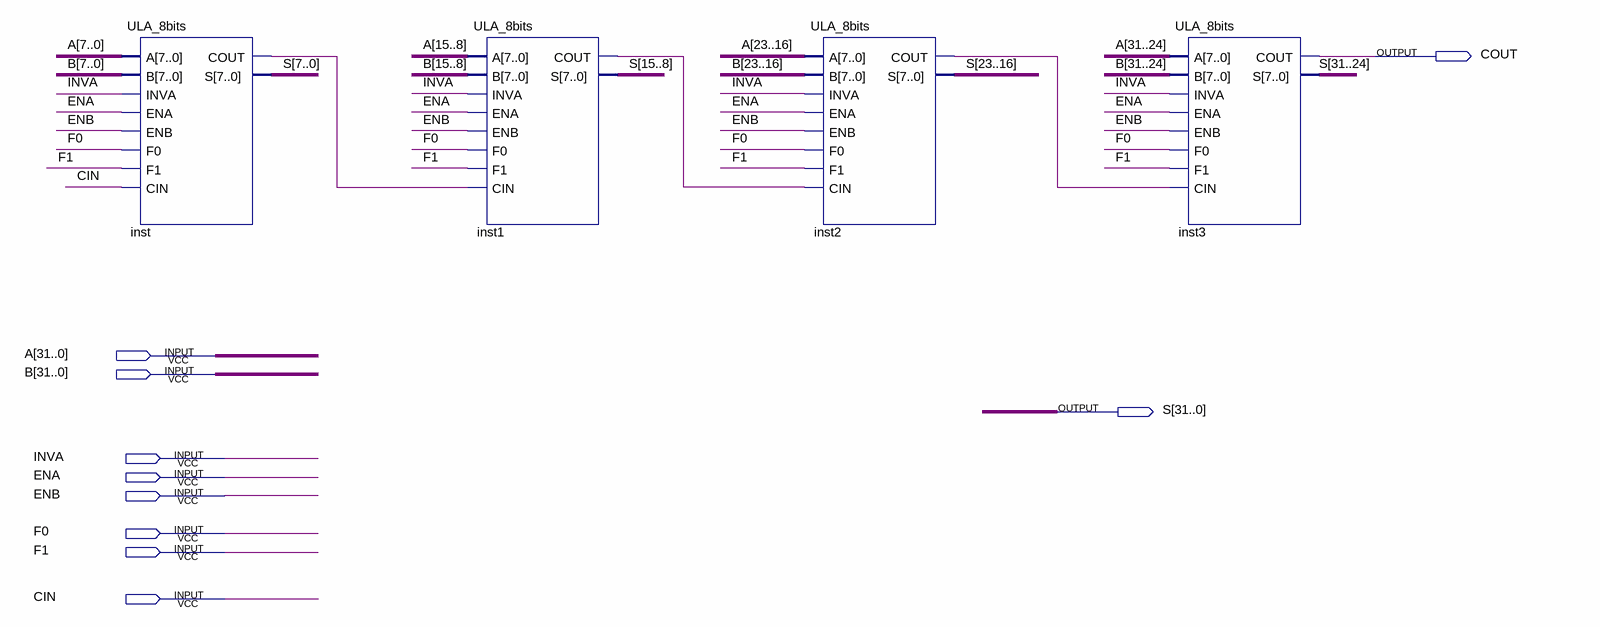
[diagram p0: schematic sheet]
// Quartus schematic ULA_32.bdf as structural Verilog: 4 symbols, 10 pins
module ULA_32 (
  input  [31:0] A,
  input  [31:0] B,
  input  INVA,
  input  ENA,
  input  ENB,
  input  F0,
  input  F1,
  input  CIN,
  output COUT,
  output [31:0] S
);

  wire inst1_cout, inst2_cout, inst_cout;

  ULA_8bits inst (
    .A(A[7:0]), .B(B[7:0]), .INVA(INVA), .ENA(ENA), .ENB(ENB), .F0(F0), .F1(F1), .CIN(CIN), .COUT(inst_cout),
    .S(S[7:0]));
  ULA_8bits inst1 (
    .A(A[15:8]), .B(B[15:8]), .INVA(INVA), .ENA(ENA), .ENB(ENB), .F0(F0), .F1(F1), .CIN(inst_cout),
    .COUT(inst1_cout), .S(S[15:8]));
  ULA_8bits inst2 (
    .A(A[23:16]), .B(B[23:16]), .INVA(INVA), .ENA(ENA), .ENB(ENB), .F0(F0), .F1(F1), .CIN(inst1_cout),
    .COUT(inst2_cout), .S(S[23:16]));
  ULA_8bits inst3 (
    .A(A[31:24]), .B(B[31:24]), .INVA(INVA), .ENA(ENA), .ENB(ENB), .F0(F0), .F1(F1), .CIN(inst2_cout),
    .COUT(COUT), .S(S[31:24]));
endmodule
